# EAGLE design touch-switch-controller (EAGLE 6.4)
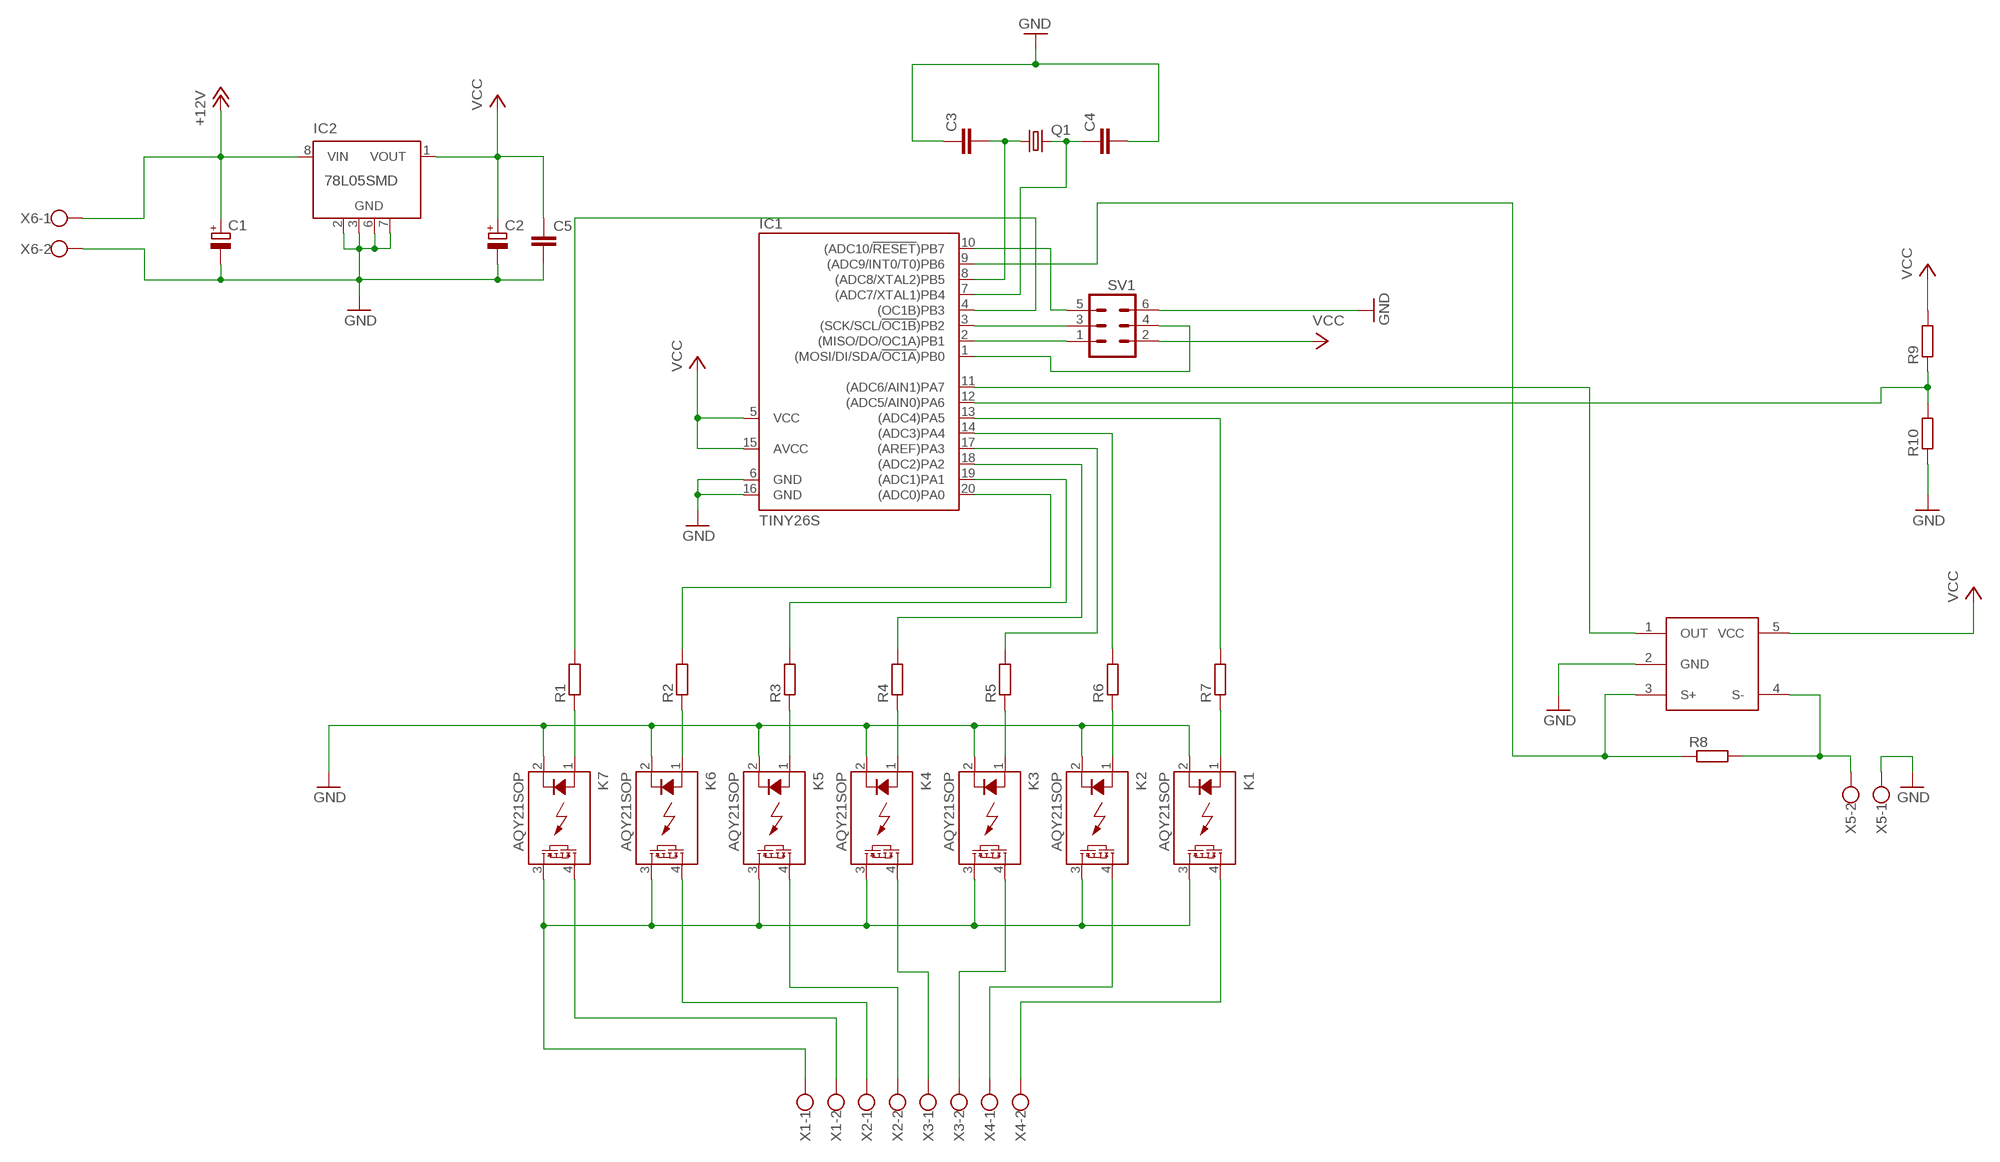
[diagram p0: schematic, sheet 1]

## Parts
C1  CPOL-EUE3.5-8  [E3,5-8]
C2  CPOL-EUE3.5-8  [E3,5-8]
C3  C-EUC0603  [C0603]
C4  C-EUC0603  [C0603]
C5  C-EUC0603  [C0603]
IC1  TINY26S  [SO20L]
IC2  78L05SMD  [SO08]
K1  AQY21SOP  [SOP04]
K2  AQY21SOP  [SOP04]
K3  AQY21SOP  [SOP04]
K4  AQY21SOP  [SOP04]
K5  AQY21SOP  [SOP04]
K6  AQY21SOP  [SOP04]
K7  AQY21SOP  [SOP04]
Q1  CRYSTALHC49UP  [HC49UP]
R1  R-EU_R0603  [R0603]
R2  R-EU_R0603  [R0603]
R3  R-EU_R0603  [R0603]
R4  R-EU_R0603  [R0603]
R5  R-EU_R0603  [R0603]
R6  R-EU_R0603  [R0603]
R7  R-EU_R0603  [R0603]
R8  R-EU_R0603  [R0603]
R9  R-EU_R0603  [R0603]
R10  R-EU_R0603  [R0603]
SV1  MA03-2  [MA03-2]
U$1  ZXCT1086  [SOT23-5L]
X1  W237-102  [W237-102]
X2  W237-102  [W237-102]
X3  W237-102  [W237-102]
X4  W237-102  [W237-102]
X5  W237-102  [W237-102]
X6  W237-102  [W237-102]

## Nets
+12V: C1.+ IC2.8(VIN) X6.1
GND: C1.- C2.- C3.1 C4.2 C5.2 IC1.6(GND) IC1.16(GND) IC2.2(GND) IC2.3(GND) IC2.6(GND) IC2.7(GND) K1.2(K) K2.2(K) K3.2(K) K4.2(K) K5.2(K) K6.2(K) K7.2(K) R10.1 SV1.6 U$1.2(GND) X5.1 X6.2
N$1: IC1.12((ADC5/AIN0)PA6) R9.1 R10.2
N$2: IC1.13((ADC4)PA5) R7.2
N$3: IC1.4((OC1B)PB3) R1.2
N$4: IC1.20((ADC0)PA0) R2.2
N$5: IC1.19((ADC1)PA1) R3.2
N$6: IC1.9((ADC9/INT0/T0)PB6) R8.1 U$1.3(S+)
N$7: IC1.17((AREF)PA3) R5.2
N$8: IC1.2((MISO/DO/OC1A)PB1) SV1.1
N$9: IC1.3((SCK/SCL/!OC1B!)PB2) SV1.3
N$10: IC1.10((ADC10/!RESET!)PB7) SV1.5
N$11: IC1.1((MOSI/DI/SDA/!OC1A!)PB0) SV1.4
N$13: K7.4(DS1) X1.2
N$14: K7.1(A) R1.1
N$15: K6.4(DS1) X2.1
N$16: K5.4(DS1) X2.2
N$17: K4.4(DS1) X3.1
N$18: K6.1(A) R2.1
N$19: K5.1(A) R3.1
N$20: K4.1(A) R4.1
N$21: K3.1(A) R5.1
N$22: K2.1(A) R6.1
N$23: K1.1(A) R7.1
N$24: K3.4(DS1) X3.2
N$25: K2.4(DS1) X4.1
N$26: K1.4(DS1) X4.2
N$27: K1.3(DS2) K2.3(DS2) K3.3(DS2) K4.3(DS2) K5.3(DS2) K6.3(DS2) K7.3(DS2) X1.1
N$29: R8.2 U$1.4(S-) X5.2
N$31: IC1.11((ADC6/AIN1)PA7) U$1.1(OUT)
N$32: C3.2 IC1.8((ADC8/XTAL2)PB5) Q1.1
N$33: C4.1 IC1.7((ADC7/XTAL1)PB4) Q1.2
N$37: IC1.18((ADC2)PA2) R4.2
N$38: IC1.14((ADC3)PA4) R6.2
VCC: C2.+ C5.1 IC1.5(VCC) IC1.15(AVCC) IC2.1(VOUT) R9.2 SV1.2 U$1.5(VCC)
Unconnected: IC2.4(NC) IC2.5(NC)

## Library data of the parts
C1 C2 = resistor:CPOL-EU: POLARIZED CAPACITOR, European symbol
C3-C5 = resistor:C-EU: CAPACITOR, European symbol
IC1 = atmel:TINY26*: 8-bit AVR Microcontroller with 2K Bytes Flash Source: http://www.atmel.com .. doc1477.pdf; MPN: ATTINY261-20SU; OC_FARNELL: 1455147; OC_NEWARK: 58M3783
IC2 = linear:78L*SMD: Positive VOLTAGE REGULATOR
K1-K7 = relay:AQY*: PhotoMOS Relay NAiS Source: http://www.panasonic-electric-works.com/catalogues/downloads/photomos/ds_x615_en_aqz10_20.pdf; OC_FARNELL: unknown; OC_NEWARK: unknown
Q1 = crystal:CRYSTAL: CRYSTAL; OC_FARNELL: unknown; OC_NEWARK: unknown
R1-R10 = resistor:R-EU_: RESISTOR, European symbol
SV1 = con-lstb:MA03-2: PIN HEADER; OC_FARNELL: unknown; OC_NEWARK: unknown
U$1 = __SR:ZXCT1086
X1-X6 = con-wago-500:W237-102: WAGO SCREW CLAMP; MPN: 237-102; OC_FARNELL: unknown; OC_NEWARK: 70K9898

## Board
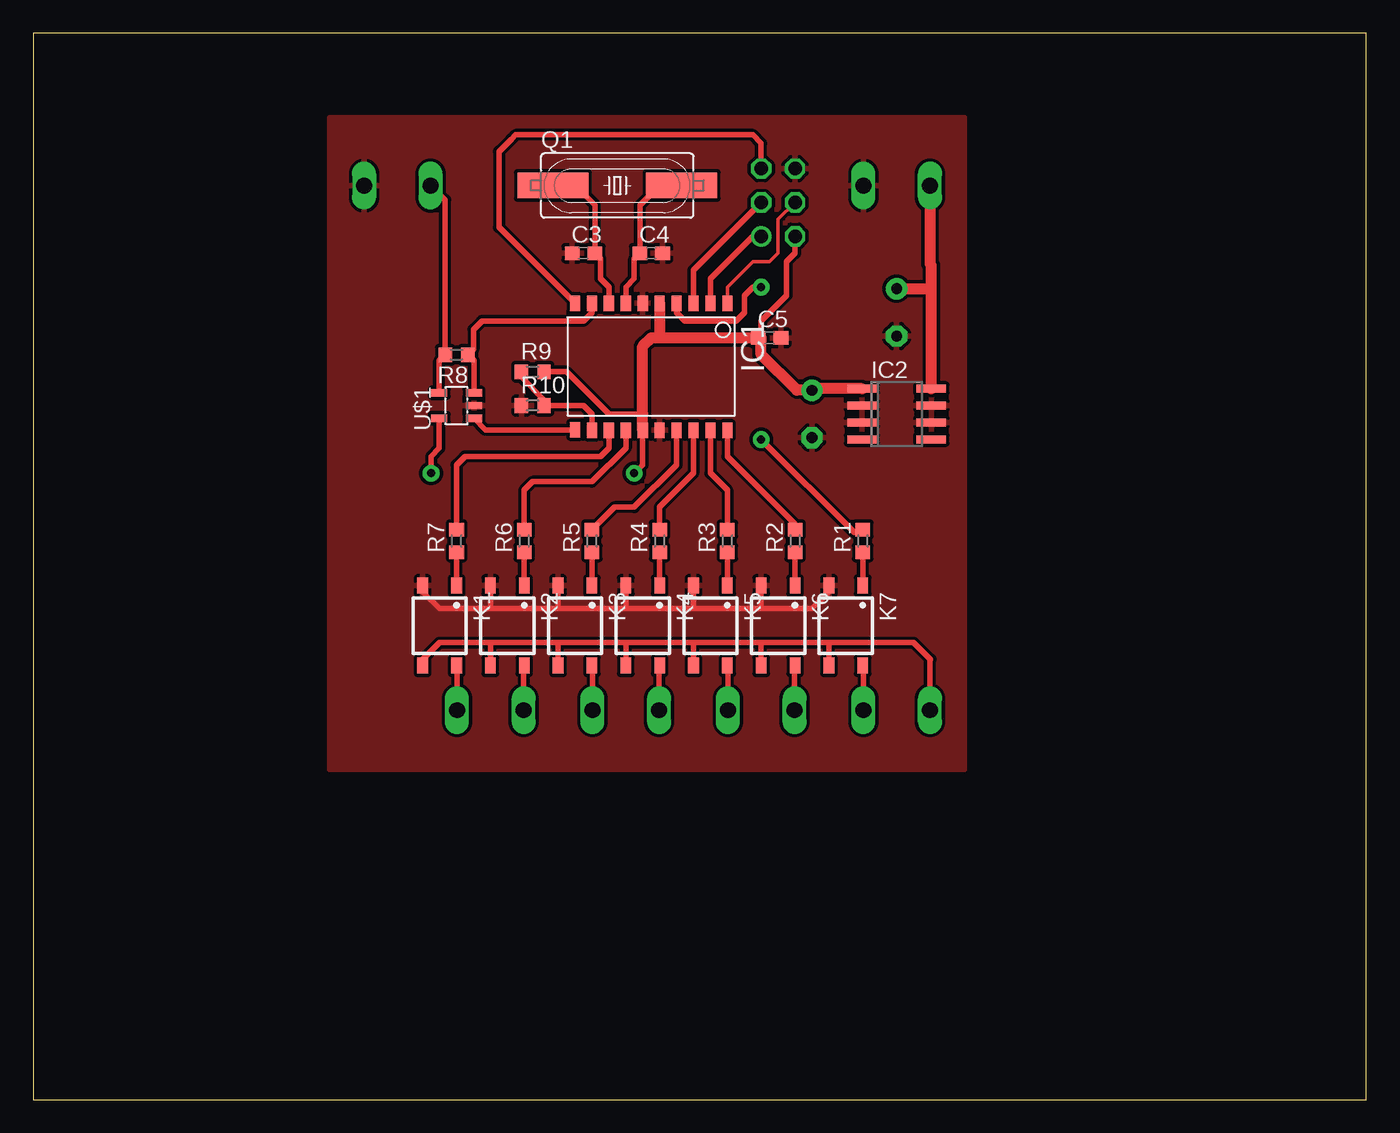
[diagram p1: board, top side]
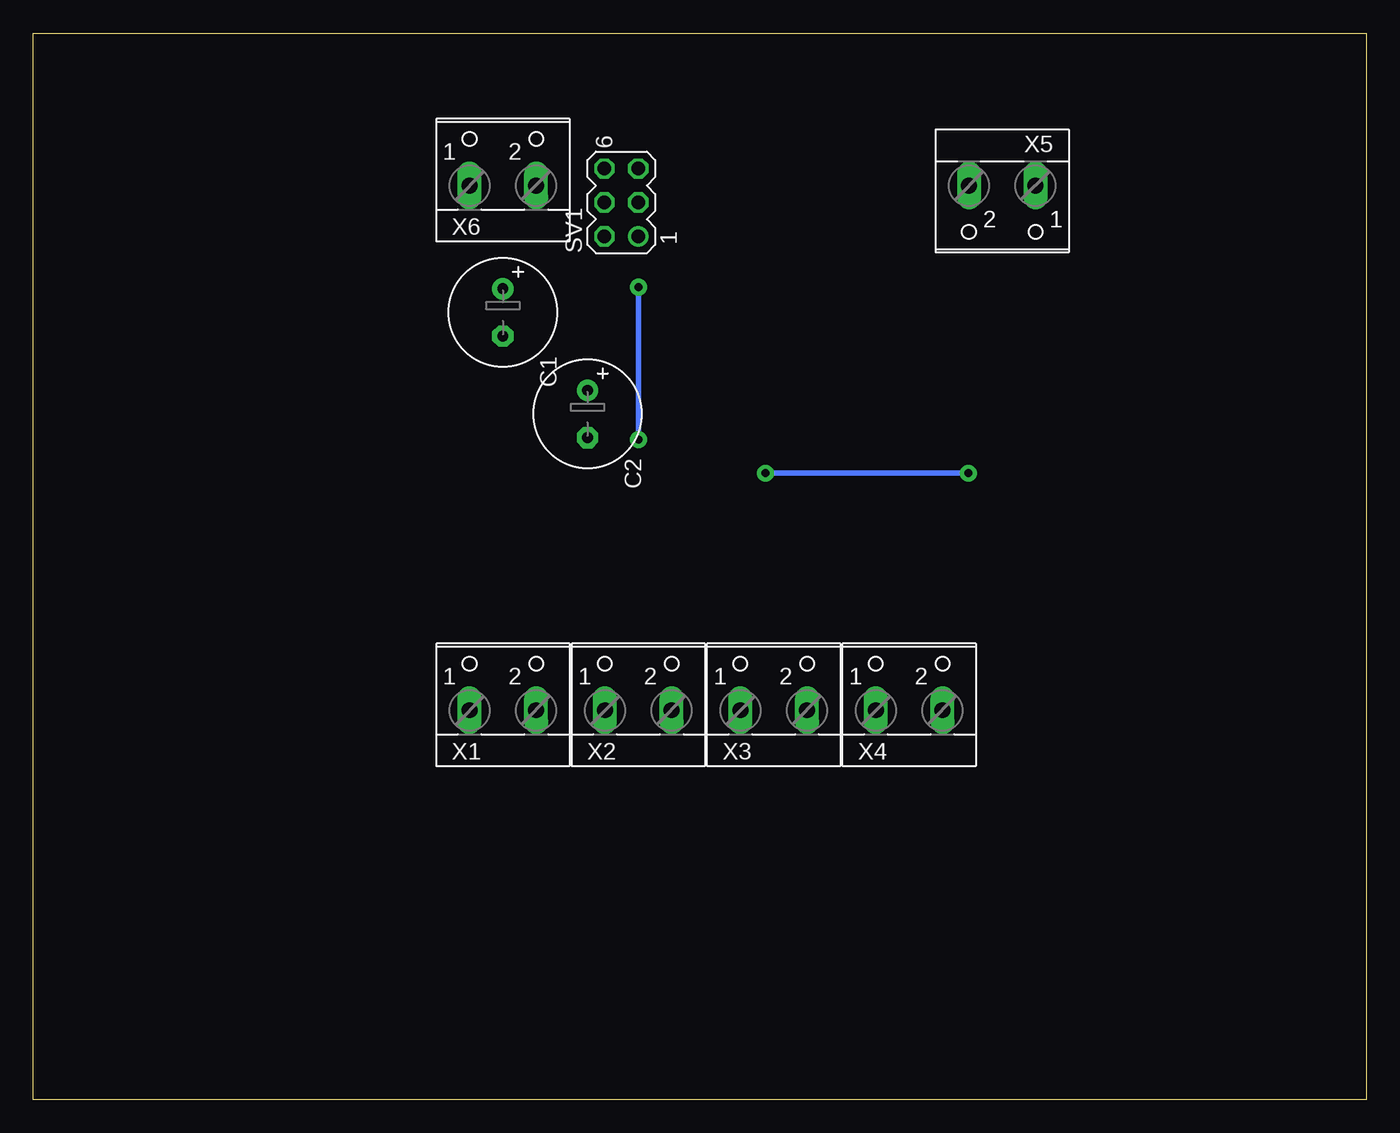
[diagram p2: board, bottom side, seen from below]

Size 100 x 80 mm. Coordinates in mm from the lower left corner, seen from the top.
Outline: 0,0 100,0 100,80 0,80 0,0
Copper layers (1*16): Top 0.035mm / dielectric 1.5mm / Bottom 0.035mm
Design rules "default": minimum track width 10mil, minimum drill 24mil, track to track 8mil, track to pad 8mil, pad to pad 8mil, via to via 8mil, smd to smd 8mil, copper to edge 40mil, drill to drill 8mil, minimum pad ring 10mil, minimum via ring 8mil, stop-mask expansion 4mil, vias tented up to drill 0mil, thermal gap 10mil

### Footprints (pad centres in the part's own frame; a part is rotated, then mirrored left to right if it is on the bottom)
E3,5-8 = drill 0.813 pad 1.6: + -1.778,0 | drill 0.813 pad 1.6 octagon: - 1.778,0
C0603 = smd 1.1 x 1: 1 -0.85,0; 2 0.85,0
SO20L = smd 0.762 x 1.143: 1 -5.08,-5.131; 2 -3.81,-5.131; 3 -2.54,-5.131; 4 -1.27,-5.131; 5 0,-5.131; 6 1.27,-5.131; 7 2.54,-5.131; 8 3.81,-5.131; 9 5.08,-5.131; 10 6.35,-5.131; 11 6.35,4.369; 12 5.08,4.394; 13 3.81,4.394; 14 2.54,4.394; 15 1.27,4.394; 16 0,4.394; 17 -1.27,4.394; 18 -2.54,4.394; 19 -3.81,4.394; 20 -5.08,4.394
SO08 = smd 0.6 x 2.2: 1 -1.905,-2.6; 2 -0.635,-2.6; 3 0.635,-2.6; 4 1.905,-2.6; 5 1.905,2.6; 6 0.635,2.6; 7 -0.635,2.6; 8 -1.905,2.6
SOP04 = smd 0.8 x 1.2: 1 -1.27,-3; 2 1.27,-3; 3 1.27,3; 4 -1.27,3
HC49UP = smd 5.334 x 1.93: 1 -4.826,0; 2 4.826,0
R0603 = smd 1 x 1.1: 1 -0.85,0; 2 0.85,0
MA03-2 = drill 1.016: 1 -2.54,-1.27 | drill 1.016 octagon: 2 -2.54,1.27; 3 0,-1.27; 4 0,1.27; 5 2.54,-1.27; 6 2.54,1.27
SOT23-5L = smd 0.55 x 1.2: 1 -0.95,-1.3; 2 0,-1.3; 3 0.95,-1.3; 4 0.95,1.3; 5 -0.95,1.3
W237-102 = drill 1.194 long: 1 -2.5,-1.27; 2 2.5,-1.27

### Placement (x,y rotation side)
C1  64.77,59.05 270 bottom
C2  58.42,51.44 270 bottom
C3  41.27,63.5 0 top
C4  46.35,63.5 0 top
C5  55.24,57.15 0 top
IC1  46.99,54.61 180 top
IC2  64.77,51.44 270 top
K1  30.48,35.56 180 top
K2  35.56,35.56 180 top
K3  40.64,35.56 180 top
K4  45.72,35.56 180 top
K5  50.8,35.56 180 top
K6  55.88,35.56 180 top
K7  60.96,35.56 180 top
Q1  43.81,68.58 0 top
R1  62.23,41.91 90 top
R2  57.15,41.91 90 top
R3  52.07,41.91 90 top
R4  46.99,41.91 90 top
R5  41.91,41.91 90 top
R6  36.83,41.91 90 top
R7  31.75,41.91 90 top
R8  31.75,55.88 180 top
R9  37.47,54.61 0 top
R10  37.47,52.07 0 top
SV1  55.88,67.31 90 bottom
U$1  31.75,52.07 90 top
X1  64.77,30.48 0 bottom
X2  54.61,30.48 0 bottom
X3  44.45,30.48 0 bottom
X4  34.29,30.48 0 bottom
X5  27.3,67.31 180 bottom
X6  64.77,69.85 0 bottom

### Tracks (layer width: path | path; a pad name or v marks a point on that pad's centre or on a via)
+12V
  Top 0.813: X6.1 67.27,62.7 67.37,62.6 67.37,60.96 | IC2.8 67.37,60.96 | C1.+ 67.24,60.83 67.37,60.96
GND
  Top 0.406: K1.2 29.21,38.1 30.48,36.83 34.29,36.83 | 34.29,36.83 39.37,36.83 | 39.37,36.83 44.45,36.83 | 44.45,36.83 49.53,36.83 | 49.53,36.83 54.61,36.83 | 54.61,36.83 58.42,36.83 59.69,38.1 K7.2 | K2.2 34.29,36.83 | K3.2 39.37,36.83 | K4.2 44.45,36.83 | K5.2 49.53,36.83 | K6.2 54.61,36.83
  pour Top (isolate 0.254): 22.23,73.66 69.85,73.66 69.85,24.77 22.23,24.77
N$1
  Top 0.406: IC1.12 41.91,51.44 41.27,52.07 R10.2 38.31,52.49 36.62,54.19 R9.1
N$2
  Top 0.406: IC1.13 43.18,48.9 42.55,48.26 32.38,48.26 31.75,47.62 R7.2
N$3  (via drill 0.6 pad 1.27)
  Top 0.406: IC1.4 48.26,59.05 48.9,58.42 52.7,58.42 53.34,59.05 53.34,60.33 53.98,60.96 v54.61,60.96 | v54.61,49.53 61.59,42.55 62.02,42.55 R1.2
  Bottom 0.406: v54.61,60.96 v54.61,49.53
N$4
  Top 0.406: IC1.20 52.07,48.26 57.15,43.18 R2.2
N$5
  Top 0.406: IC1.19 50.8,46.99 52.07,45.72 R3.2
N$6
  Top 0.406: U$1.3 33.05,55.43 R8.1 33.02,56.3 33.02,57.78 33.66,58.42 41.27,58.42 41.91,59.05 IC1.9
N$7
  Top 0.406: IC1.17 48.26,47.62 45.09,44.45 43.6,44.45 R5.2
N$8
  Top 0.406: IC1.2 50.8,61.59 53.98,64.77 SV1.1
N$9
  Top 0.406: IC1.3 49.53,62.23 SV1.3
N$10
  Top 0.406: IC1.10 34.92,65.46 34.92,71.12 35.88,72.07 36.2,72.39 53.98,72.39 54.61,71.75 SV1.5
N$11
  Top 0.254: IC1.1 52.07,60.96 53.98,62.87 55.24,62.87 55.88,63.5 55.88,66.04 SV1.4
N$13
  Top 0.406: K7.4 62.27,32.56 X1.2
N$14
  Top 0.406: K7.1 R1.1
N$15
  Top 0.406: K6.4 57.11,32.56 X2.1
N$16
  Top 0.406: X2.2 52.11,32.52 K5.4
N$17
  Top 0.406: K4.4 46.95,32.56 X3.1
N$18
  Top 0.406: K6.1 R2.1
N$19
  Top 0.406: K5.1 R3.1
N$20
  Top 0.406: K4.1 R4.1
N$21
  Top 0.406: K3.1 R5.1
N$22
  Top 0.406: K2.1 R6.1
N$23
  Top 0.406: K1.1 R7.1
N$24
  Top 0.406: K3.4 41.95,32.56 X3.2
N$25
  Top 0.406: K2.4 36.79,32.56 X4.1
N$26
  Top 0.406: K1.4 31.79,32.56 X4.2
N$27
  Top 0.406: K1.3 29.21,33.02 30.48,34.29 34.29,34.29 | 34.29,34.29 39.37,34.29 | 39.37,34.29 44.45,34.29 | 44.45,34.29 49.53,34.29 | 49.53,34.29 54.61,34.29 | 54.61,34.29 59.69,34.29 | 59.69,34.29 66.04,34.29 67.31,33.02 67.27,32.98 X1.1 | K2.3 34.29,34.29 | K3.3 39.37,34.29 | K4.3 44.45,34.29 | K5.3 49.53,34.29 | K6.3 54.61,34.29 | K7.3 59.69,34.29
N$29
  Top 0.406: U$1.4 30.45,55.43 R8.2 30.9,67.48 X5.2
N$31
  Top 0.406: IC1.11 33.93,50.24 U$1.1
N$32
  Top 0.406: 39.37,68.58 Q1.1 | IC1.8 43.18,60.96 42.55,61.59 42.55,63.08 C3.2 42.12,67.09 40.64,68.58 Q1.1 | 38.73,68.58 Q1.1
N$33
  Top 0.406: IC1.7 44.45,60.96 45.09,61.59 45.09,63.08 C4.1 45.51,67.09 46.99,68.58 Q1.2
N$37
  Top 0.406: IC1.18 49.53,46.99 46.99,44.45 R4.2
N$38
  Top 0.406: IC1.14 44.45,48.9 41.91,46.35 37.47,46.35 36.83,45.72 R6.2
VCC  (via drill 0.6 pad 1.27)
  Top 0.406: 45.72,51.44 43.18,51.44 40.01,54.61 R9.2 | U$1.5 30.45,48.87 29.84,48.26 v29.84,46.99 | IC1.15 45.72,47.62 v45.09,46.99 | SV1.2 57.15,63.5 56.52,62.87 56.52,60.33 54.61,58.42 54.61,57.15
  Top 0.813: IC1.15 45.72,51.44 45.72,56.52 46.35,57.15 46.99,57.15 | 54.61,57.15 C5.1 | C5.1 46.99,57.15 | IC1.5 46.99,57.15 | C5.1 54.61,56.94 54.61,55.88 57.28,53.21 C2.+ 58.55,53.34 IC2.1
  Bottom 0.406: v45.09,46.99 v29.84,46.99